# EAGLE schematic MMC-Badge (EAGLE 9.0.1)
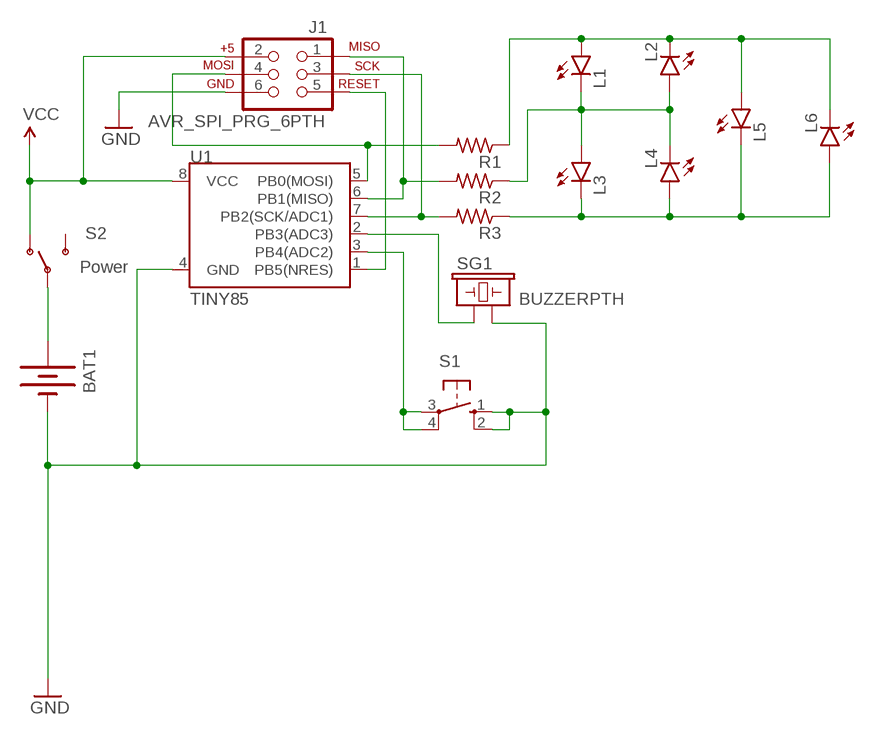
[diagram p0: schematic, sheet 1]

## Parts
BAT1  BATTERY20PTH  [BATTCOM_20MM_PTH]
J1  AVR_SPI_PRG_6PTH  [2X3]
L1  LED5MM  [LED5MM]
L2  LED5MM  [LED5MM]
L3  LED5MM  [LED5MM]
L4  LED5MM  [LED5MM]
L5  LED5MM  [LED5MM]
L6  LED5MM  [LED5MM]
R1  R-US_0204/7  [0204/7]
R2  R-US_0204/7  [0204/7]
R3  R-US_0204/7  [0204/7]
S1  10-XX  [B3F-10XX]
S2  Power  SWITCH-SPDTPTH  [SWITCH-SPDT]
SG1  BUZZERPTH  [BUZZER-12MM]
U1  TINY85  ATTINY45TINY85-20-DIP  [DIP08]

## Nets
GND: BAT1.2(-) J1.6 S1.1(S) S1.2(S1) SG1.- U1.4(GND)
L12: L1.K(C) L2.A L3.A L4.K(C) R2.1
MISO: J1.1 R2.2 U1.6(PB1(MISO))
MOSI: J1.4 R1.2 U1.5(PB0(MOSI))
N$1: BAT1.1(+) S2.2(P)
N$2: L3.K(C) L4.A L5.K(C) L6.A R3.1
N$3: S1.3(P) S1.4(P1) U1.3(PB4(ADC2))
N$4: SG1.+ U1.2(PB3(ADC3))
N$6: L1.A L2.K(C) L5.A L6.K(C) R1.1
RST: J1.5 U1.1(PB5(NRES))
SCK: J1.3 R3.2 U1.7(PB2(SCK/ADC1))
VCC: J1.2 S2.1(O) U1.8(VCC)
Unconnected: S2.3(S)

## Library data of the parts
BAT1 = SparkFun-Electromechanical:BATTERY: Battery Holders Various common sizes : AA, AAA, 20mm coin cell and 12mm coin cell. 20MM_4LEGS, BATT-10373
J1 = SparkFun:AVR_SPI_PRG_6: AVR ISP 6 Pin This is the reduced ISP connector for AVR programming. Common on Arduino. This footprint will take up less PCB space and can be used with a 10-pin to 6-pin adapter such as SKU: BOB-08508
L1-L6 = SparkFun-LED:LED: LEDs Standard schematic elements and footprints for 5mm, 3mm, 1206, and 0603 sized LEDs. 5mm - Spark Fun Electronics SKU : COM-00529 (and others)
R1-R3 = rcl:R-US_: RESISTOR, American symbol
S1 = switch-omron:10-XX: OMRON SWITCH; MPN: B3F-1000; OC_FARNELL: 176432; OC_NEWARK: 36M3542
S2 = SparkFun-Electromechanical:SWITCH-SPDT: SPDT Switch Simple slide switch, Spark Fun Electronics SKU : COM-00102 DPDT SMT slide switch, AYZ0202, SWCH-08179
SG1 = SparkFun-Electromechanical:BUZZER: Buzzer 12mm Spark Fun Electronics SKU : Comp-Buzzer
U1 = SparkFun-DigitalIC:ATTINY45: Atmel 8-pin 2/4/8kB flash uC; PROD_ID: IC-09445; VALUE: TINY85-20-DIP